# EAGLE design adc-dac (EAGLE 8.1.0)
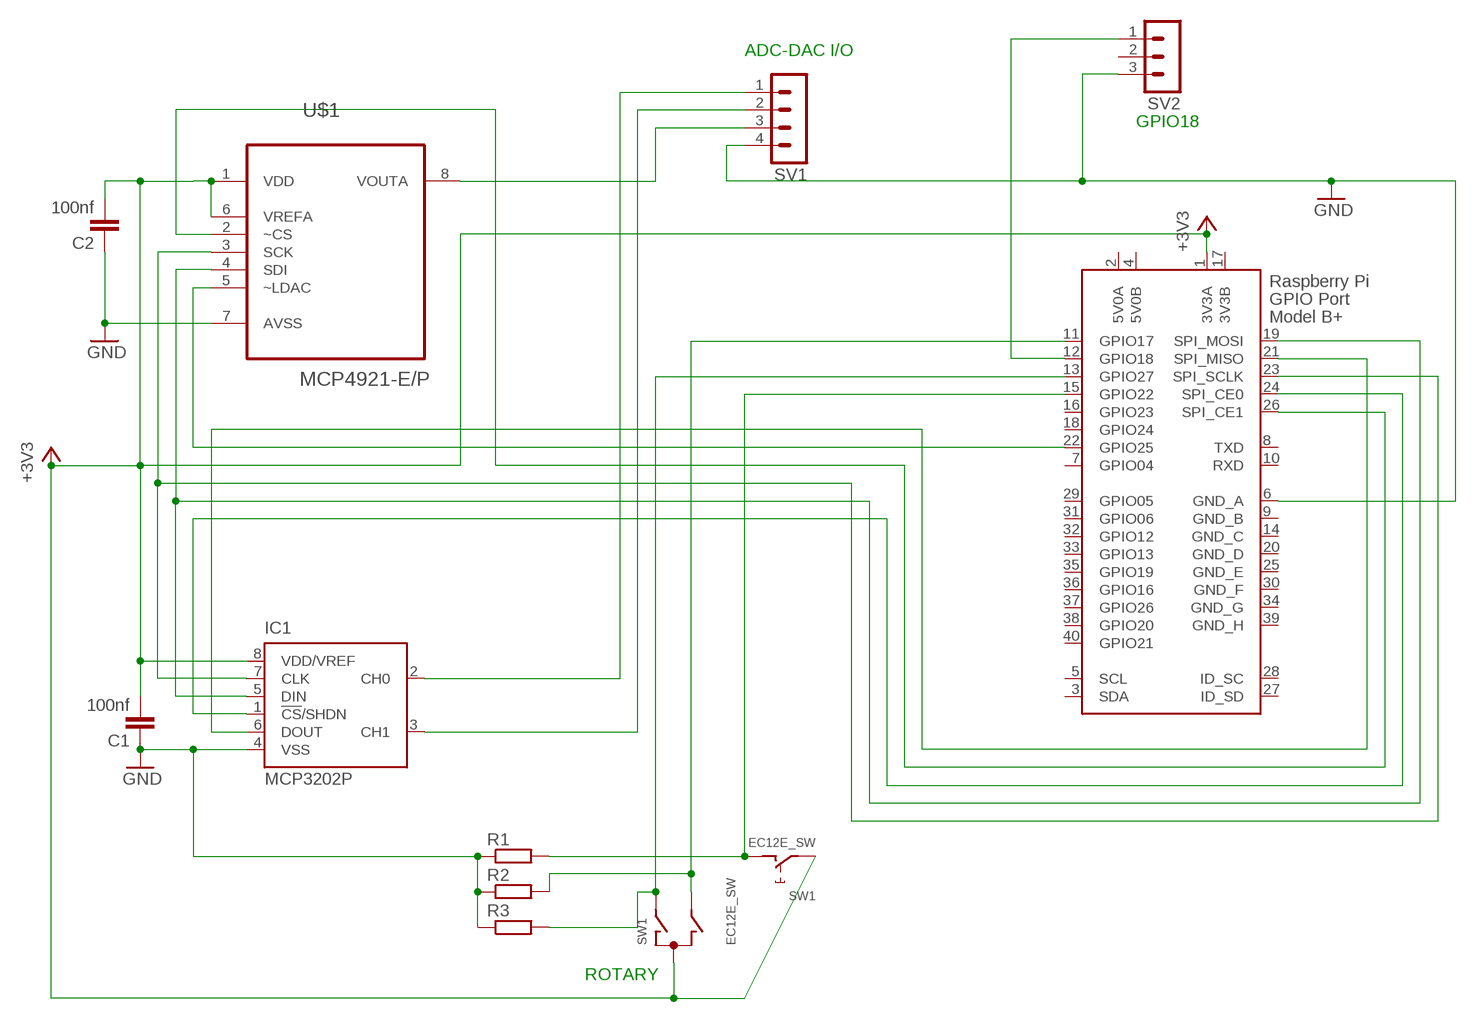
[diagram p0: schematic, sheet 1]

## Parts
C1  100nf  C-EUC1210  [C1210]
C2  100nf  C-EUC1210  [C1210]
IC1  MCP3202P  [DIL8]
R1  R-EU_0204/2V  [0204V]
R2  R-EU_0204/2V  [0204V]
R3  R-EU_0204/2V  [0204V]
SV1  MA04-1  [MA04-1]
SV2  MA03-1  [MA03-1]
SW1  EC12E_SW  [ALPS_EC12E_SW]
U$1  MCP4921-E/P  [DIP254P762X432-8]
X1  RASPI_BOARD_B+#_H  [RASPI_BOARD_B+HAT]

## Nets
+3V3: C1.2 C2.2 IC1.8(VDD/VREF) SW1.C SW1.E U$1.1(VDD) U$1.6(VREFA) X1.1(3V3A)
GND: C1.1 C2.1 IC1.4(VSS) R1.1 R2.1 R3.1 SV1.4 SV2.3 U$1.7(AVSS) X1.6(GND_A)
N$1: IC1.2(CH0) SV1.1
N$2: IC1.3(CH1) SV1.2
N$3: SV1.3 U$1.8(VOUTA)
N$6: IC1.7(CLK) U$1.3(SCK) X1.23(SPI_SCLK)
N$7: IC1.5(DIN) U$1.4(SDI) X1.19(SPI_MOSI)
N$8: U$1.5(~LDAC) X1.22(GPIO25)
N$9: IC1.1(!CS!/SHDN) X1.24(SPI_CE0)
N$10: U$1.2(~CS) X1.26(SPI_CE1)
N$11: IC1.6(DOUT) X1.21(SPI_MISO)
N$12: R1.2 SW1.D X1.15(GPIO22)
N$13: R3.2 SW1.A X1.13(GPIO27)
N$14: R2.2 SW1.B X1.11(GPIO17)
N$15: SV2.1 X1.12(GPIO18)
Unconnected: SV2.2 SW1.GND1(G) SW1.GND2(G) X1.3(SDA) X1.5(SCL) X1.7(GPIO04) X1.8(TXD) X1.10(RXD) X1.16(GPIO23) X1.18(GPIO24) X1.27(ID_SD) X1.28(ID_SC) X1.29(GPIO05) X1.31(GPIO06) X1.32(GPIO12) X1.33(GPIO13) X1.35(GPIO19) X1.36(GPIO16) X1.37(GPIO26) X1.38(GPIO20) X1.40(GPIO21)

## Notes on the sheet
- ADC-DAC I/O
- GPIO18
- ROTARY

## Power pins joined to a net without a drawn wire
3V3B: X1.17(3V3B)
5V0A: X1.2(5V0A)
5V0B: X1.4(5V0B)
GND_B: X1.9(GND_B)
GND_C: X1.14(GND_C)
GND_D: X1.20(GND_D)
GND_E: X1.25(GND_E)
GND_F: X1.30(GND_F)
GND_G: X1.34(GND_G)
GND_H: X1.39(GND_H)

## Library data of the parts
C1 C2 = rcl:C-EU: CAPACITOR, European symbol
IC1 = microchip-update:MCP3202: 2.7V Dual Channel 12-Bit A/D Converter with SPI Serial Interface Source: http://ww1.microchip.com/downloads/en/DeviceDoc/21034D.pdf
R1-R3 = resistor:R-EU_: RESISTOR, European symbol
SV1 = con-lstb:MA04-1: PIN HEADER; OC_FARNELL: unknown; OC_NEWARK: unknown
SV2 = con-lstb:MA03-1: PIN HEADER; OC_FARNELL: unknown; OC_NEWARK: unknown
SW1 = switch-alps:EC12E_SW: ALPS rotary Encoder EC12E series with switch; MPN: EC12E2424407; OC_FARNELL: 1520813; OC_NEWARK: 74M1068
U$1 = MCP4921-E_P:MCP4921-E/P: DAC; AVAILABILITY: Unavailable; DESCRIPTION: MCP4921 Series 1 Ch 12-Bit Voltage Output Digital-to-Analog Converter-PDIP-8; MF: Microchip; MP: MCP4921-E/P; PACKAGE: DIP-8 Microchip; PRICE: None
X1 = raspberrypi_bastelstube_v13:RASPI_BOARD_B+#: Raspberry Pi GPIO connector with markings for the outer dimensions of the Raspberry Pi board model B+ with different sets of drill holes or mounting pads All pins connected

## Board
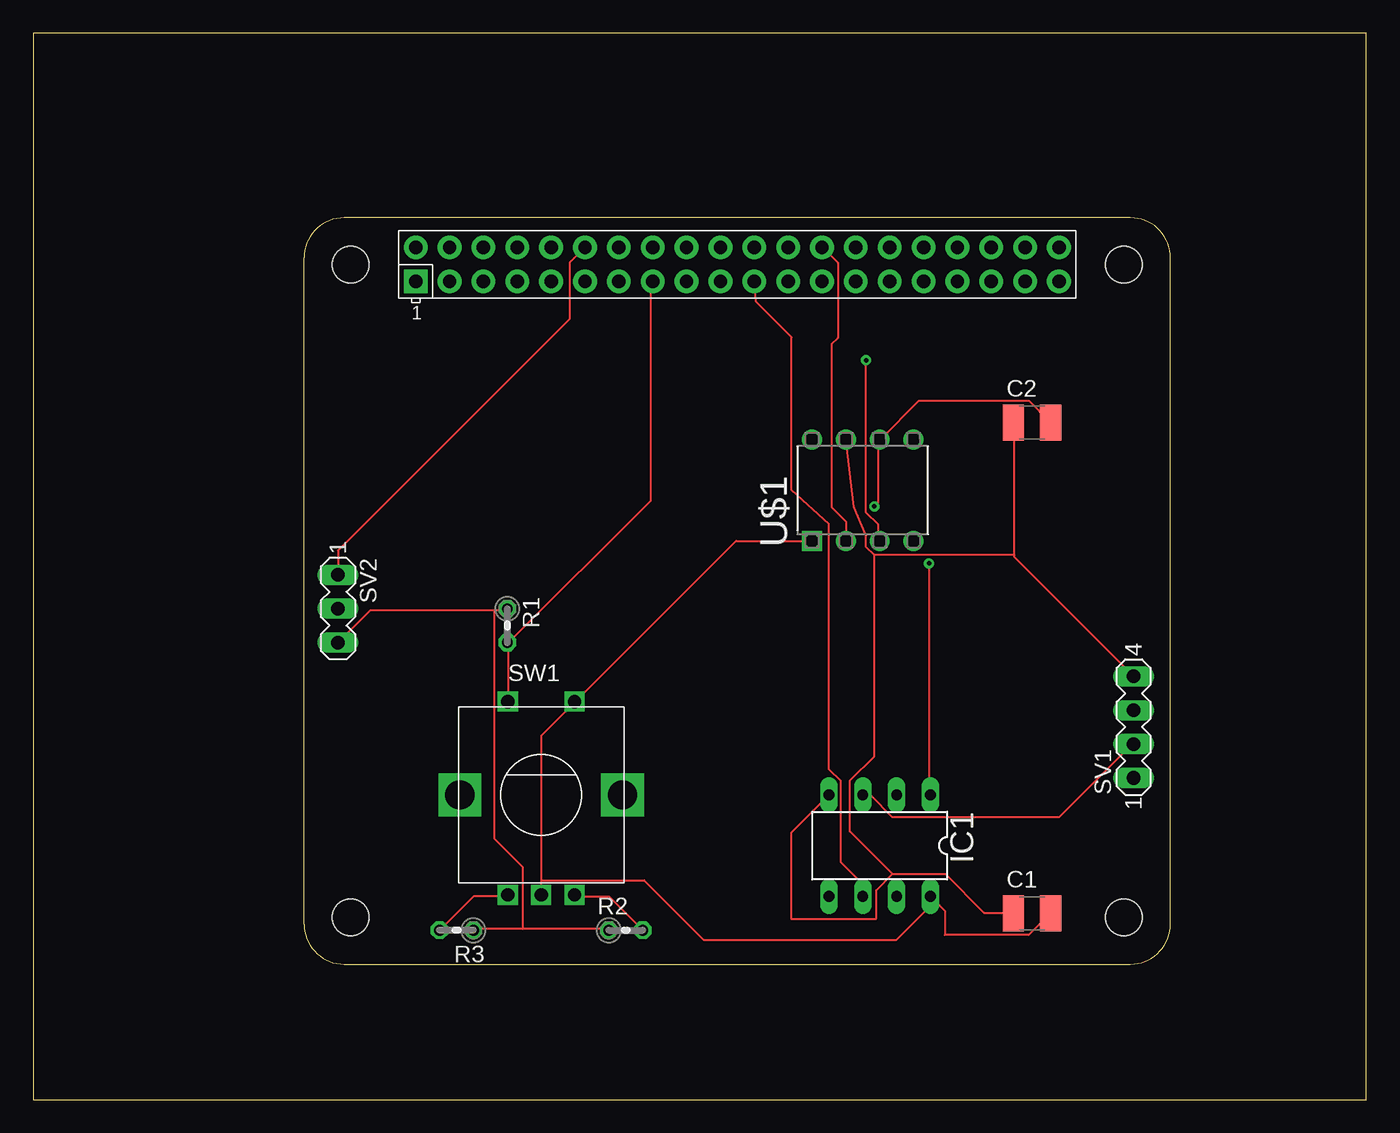
[diagram p1: board, top side]
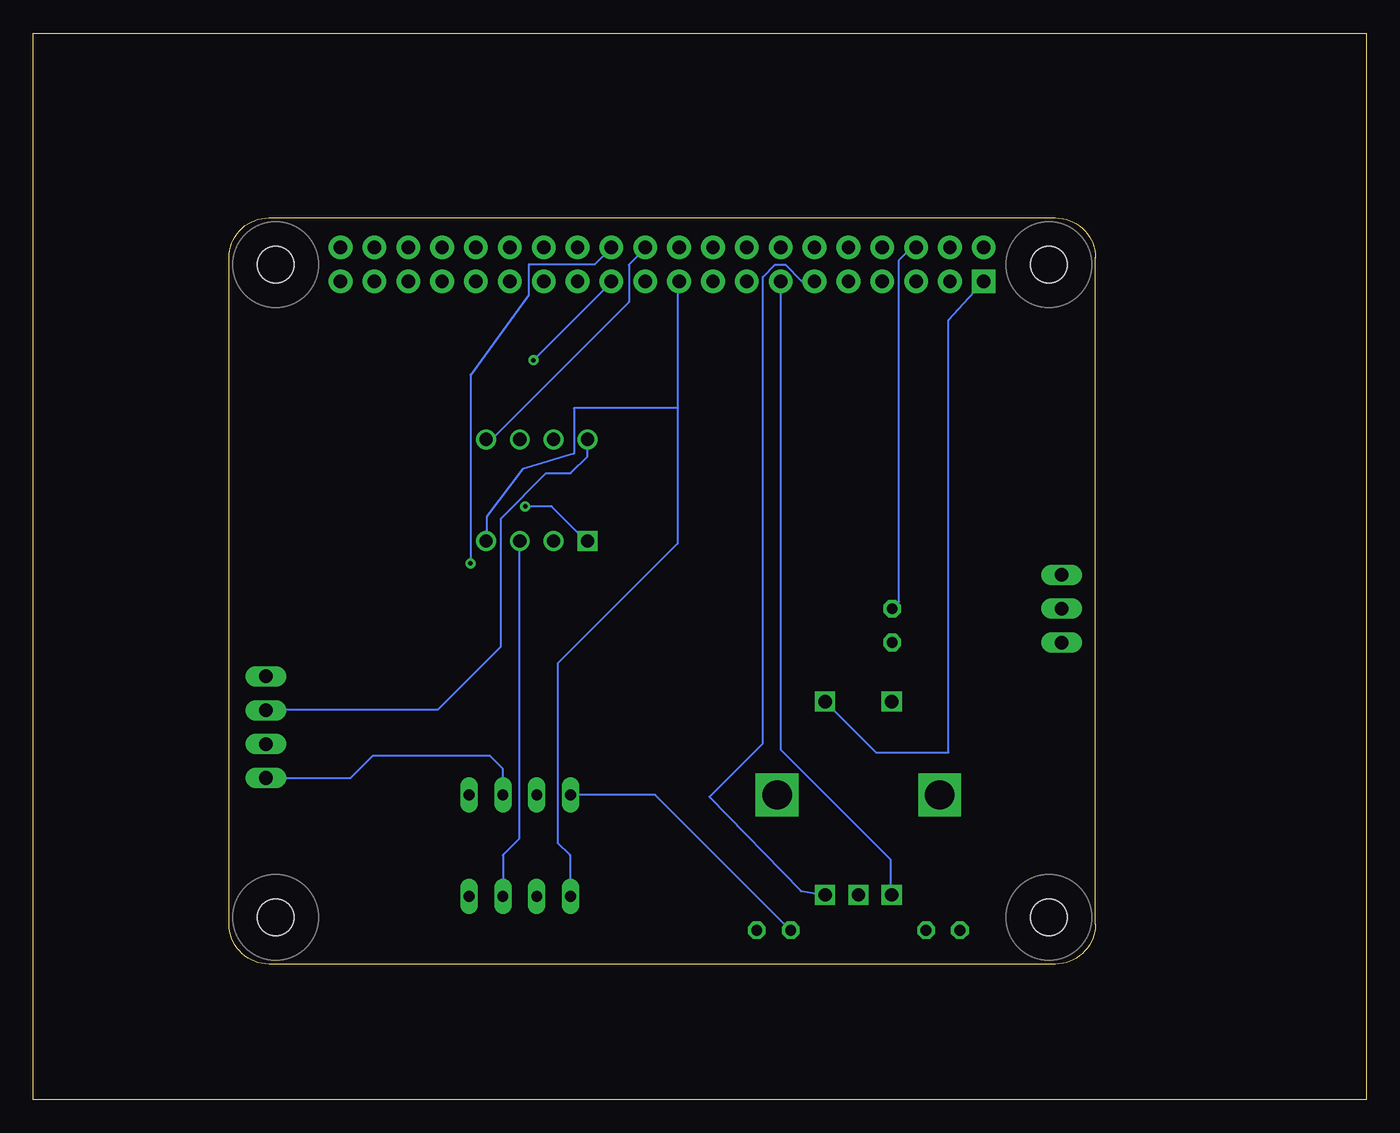
[diagram p2: board, bottom side, seen from below]

Size 100 x 80 mm. Coordinates in mm from the lower left corner, seen from the top.
Outline: 0,0 100,0 100,80 0,80 0,0
Copper layers (1*16): Top 0.035mm / dielectric 1.5mm / Bottom 0.035mm
Design rules "default": minimum track width 6mil, minimum drill 0.35mm, track to track 6mil, track to pad 6mil, pad to pad 6mil, via to via 6mil, smd to smd 6mil, copper to edge 40mil, drill to drill 6mil, minimum pad ring 10mil, minimum via ring 8mil, stop-mask expansion 4mil, vias tented up to drill 0mil, thermal gap 10mil

### Footprints (pad centres in the part's own frame; a part is rotated, then mirrored left to right if it is on the bottom)
C1210 = smd 1.6 x 2.7: 1 -1.4,0; 2 1.4,0
DIL8 = drill 0.813 long: 1 -3.81,-3.81; 2 -1.27,-3.81; 3 1.27,-3.81; 4 3.81,-3.81; 5 3.81,3.81; 6 1.27,3.81; 7 -1.27,3.81; 8 -3.81,3.81
0204V = drill 0.813 octagon: 1 -1.27,0; 2 1.27,0
MA04-1 = drill 1.016 long: 1 -3.81,0; 2 -1.27,0; 3 1.27,0; 4 3.81,0
MA03-1 = drill 1.016 long: 1 -2.54,0; 2 0,0; 3 2.54,0
ALPS_EC12E_SW = drill 1 square: A -2.5,-7.5; B 2.5,-7.5; C 0,-7.5; D -2.5,7; E 2.5,7 | drill 2.2 square: GND1 -6.1,0; GND2 6.1,0
DIP254P762X432-8 = drill 0.991 square: 1 -7.62,7.62 | drill 0.991: 2 -7.62,5.08; 3 -7.62,2.54; 4 -7.62,0; 5 0,0; 6 0,2.54; 7 0,5.08; 8 0,7.62
RASPI_BOARD_B+HAT = drill 1 pad 1.778 square: 1 8.37,51.23 | drill 1 pad 1.778: 2 8.37,53.77; 3 10.91,51.23; 4 10.91,53.77; 5 13.45,51.23; 6 13.45,53.77; 7 15.99,51.23; 8 15.99,53.77; 9 18.53,51.23; 10 18.53,53.77; 11 21.07,51.23; 12 21.07,53.77; 13 23.61,51.23; 14 23.61,53.77; 15 26.15,51.23; 16 26.15,53.77; 17 28.69,51.23; 18 28.69,53.77; 19 31.23,51.23; 20 31.23,53.77; 21 33.77,51.23; 22 33.77,53.77; 23 36.31,51.23; 24 36.31,53.77; 25 38.85,51.23; 26 38.85,53.77; 27 41.39,51.23; 28 41.39,53.77; 29 43.93,51.23; 30 43.93,53.77; 31 46.47,51.23; 32 46.47,53.77; 33 49.01,51.23; 34 49.01,53.77; 35 51.55,51.23; 36 51.55,53.77; 37 54.09,51.23; 38 54.09,53.77; 39 56.63,51.23; 40 56.63,53.77 | hole 2.75: 3.5,3.5; 3.5,52.5; 61.5,3.5; 61.5,52.5

### Placement (x,y rotation side)
C1  74.93,13.97 0 top
C2  74.93,50.8 0 top
IC1  63.5,19.05 180 top
R1  35.56,35.56 270 top
R2  44.45,12.7 0 top
R3  31.75,12.7 180 top
SV1  82.55,27.94 90 top
SV2  22.86,36.83 270 top
SW1  38.1,22.86 0 top
U$1  66.04,49.53 90 top
X1  20.32,10.16 0 top

### Tracks (layer width: path | path; a pad name or v marks a point on that pad's centre or on a via)
+3V3  (via drill 0.35)
  Top 0.152: C2.2 76.2,50.9 74.68,52.43 66.45,52.43 63.55,49.53 U$1.6 63.4,49.53 63.4,44.81 v63.09,44.5 | C1.2 76.2,13.87 74.68,12.34 68.38,12.34 68.38,14.17 IC1.8 67.31,14.53 64.77,11.99 50.29,11.99 45.82,16.46 38.1,16.46 | U$1.1 52.73,41.91 40.69,29.87 SW1.E 40.54,29.72 38.1,27.28 38.1,16.46 | 38.1,16.46 SW1.C
  Bottom 0.152: SW1.E 36.79,26.05 31.34,26.05 31.34,58.47 X1.1 | v63.09,44.5 61.11,44.5 58.52,41.91 U$1.1
GND
  Top 0.152: 34.59,36.73 25.3,36.73 SV2.3 | 34.59,36.73 35.51,36.73 R1.1 | 73.61,40.84 73.61,40.69 SV1.4 | 73.61,40.84 73.61,50.75 C2.1 | U$1.7 61.57,44.45 62.48,42.32 62.48,41.45 63.09,40.84 | 73.61,40.84 63.09,40.84 | 36.73,12.8 43.13,12.8 R2.1 | 36.73,12.8 33.07,12.8 R3.1 | 64.47,16.92 68.43,16.92 71.32,14.02 73.46,14.02 C1.1 | 64.47,16.92 63.25,15.7 63.25,13.56 56.84,13.56 56.84,20.02 IC1.4 | 63.09,40.84 63.09,25.76 61.27,23.93 61.27,20.12 64.47,16.92 | 34.59,36.73 34.59,19.56 36.73,17.42 36.73,12.8
  Bottom 0.152: X1.6 34.11,63.93 35.05,62.99 35.05,37.34 R1.1 | IC1.4 53.34,22.86 R2.1
N$1
  Bottom 0.152: IC1.2 64.77,24.79 65.79,25.81 74.52,25.81 76.2,24.13 SV1.1
N$2
  Top 0.152: IC1.3 62.79,22.86 64.47,21.18 76.96,21.18 82.45,26.67 SV1.2
N$3
  Bottom 0.152: U$1.8 58.42,48.26 59.69,46.99 61.52,46.99 64.92,43.59 64.92,33.98 69.65,29.26 82.45,29.26 SV1.3
N$6  (via drill 0.35)
  Top 0.152: v62.48,55.47 62.48,44.04 63.4,43.13 63.4,41.91 U$1.3
  Bottom 0.152: IC1.7 64.77,18.34 63.55,19.56 63.55,41.91 U$1.3 | v62.48,55.47 56.69,61.27 X1.23
N$7
  Bottom 0.152: 51.66,51.87 51.66,61.27 X1.19 | 51.66,51.87 51.66,41.71 60.66,32.72 60.66,19.25 59.74,18.34 59.74,15.24 IC1.5 | 51.66,51.87 59.44,51.87 59.44,48.46 63.3,47.3 65.99,43.74 65.99,41.91 U$1.4
N$8
  Bottom 0.152: U$1.5 65.63,49.53 55.32,59.84 55.32,62.64 54.1,63.86 X1.22
N$9  (via drill 0.35)
  Top 0.152: v67.21,40.23 67.21,22.86 IC1.1
  Bottom 0.152: v67.21,40.23 67.21,54.36 62.83,60.36 62.83,62.66 57.9,62.66 X1.24
N$10
  Top 0.152: U$1.2 60.96,43.38 59.89,44.45 59.89,56.69 60.35,57.15 60.35,62.79 59.28,63.86 X1.26
N$11
  Top 0.152: IC1.6 62.18,15.24 62.18,16.2 60.58,17.8 60.58,23.89 59.69,24.78 59.69,43.18 56.9,45.72 56.9,57.2 54.24,59.86 X1.21
N$12
  Top 0.152: 35.66,34.29 35.66,29.87 SW1.D | 35.66,34.29 46.33,44.96 46.33,61.27 X1.15 | 35.66,34.29 R1.2
N$13
  Top 0.152: R3.2 30.48,12.8 30.58,12.8 33.02,15.24 35.51,15.24 SW1.A
  Bottom 0.152: X1.13 43.89,61.27 43.89,26.21 35.66,17.98 35.66,15.39 SW1.A
N$14
  Top 0.152: R2.2 45.72,12.8 45.62,12.8 43.18,15.24 40.69,15.24 SW1.B
  Bottom 0.152: X1.11 41.45,61.42 42.37,61.42 43.59,62.64 44.35,62.64 45.26,61.72 45.26,26.72 49.28,22.71 42.42,15.65 SW1.B
N$15
  Top 0.152: SV2.1 22.86,41.2 40.23,58.57 40.23,62.79 41.3,63.86 X1.12